# Altium schematic sheet schematic.SchDoc
size A4; SheetNumber: 6; SheetTotal: 29
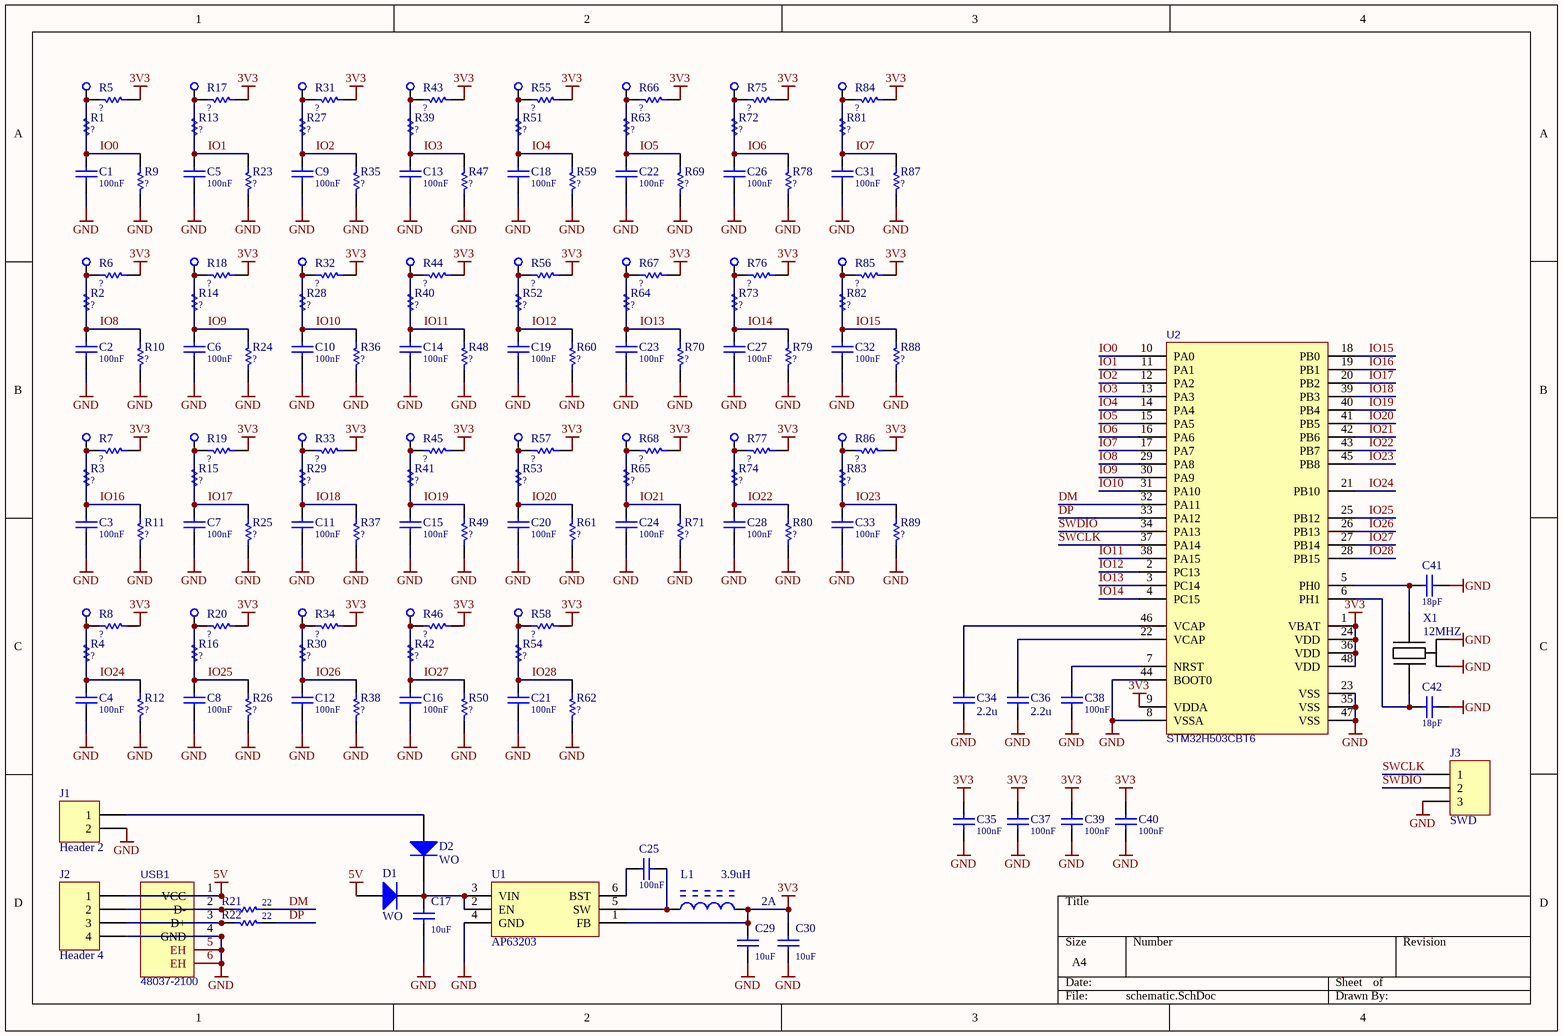
[diagram p0: schematic.SchDoc]

## Parts
C1  100nF  [C0603]
C2  100nF  [C0603]
C3  100nF  [C0603]
C4  100nF  [C0603]
C5  100nF  [C0603]
C6  100nF  [C0603]
C7  100nF  [C0603]
C8  100nF  [C0603]
C9  100nF  [C0603]
C10  100nF  [C0603]
C11  100nF  [C0603]
C12  100nF  [C0603]
C13  100nF  [C0603]
C14  100nF  [C0603]
C15  100nF  [C0603]
C16  100nF  [C0603]
C17  10uF  [C1206]
C18  100nF  [C0603]
C19  100nF  [C0603]
C20  100nF  [C0603]
C21  100nF  [C0603]
C22  100nF  [C0603]
C23  100nF  [C0603]
C24  100nF  [C0603]
C25  100nF  [C0402]
C26  100nF  [C0603]
C27  100nF  [C0603]
C28  100nF  [C0603]
C29  10uF  [C1206]
C30  10uF  [C1206]
C31  100nF  [C0603]
C32  100nF  [C0603]
C33  100nF  [C0603]
C34  2.2u  [C0603]
C35  100nF  [C0402]
C36  2.2u  [C0603]
C37  100nF  [C0402]
C38  100nF  [C0402]
C39  100nF  [C0402]
C40  100nF  [C0402]
C41  18pF  [C0402]
C42  18pF  [C0402]
D1  WO  [SMA]
D2  WO  [SMA]
DN1  (no value)  [PAD_CAST2_0.8MM]  (no BOM)
DN2  (no value)  [PAD_CAST2_0.8MM]  (no BOM)
DN3  (no value)  [PAD_CAST2_0.8MM]  (no BOM)
DN4  (no value)  [PAD_CAST2_0.8MM]  (no BOM)
DN5  (no value)  [PAD_CAST2_0.8MM]  (no BOM)
DN6  (no value)  [PAD_CAST2_0.8MM]  (no BOM)
DN7  (no value)  [PAD_CAST2_0.8MM]  (no BOM)
DN8  (no value)  [PAD_CAST2_0.8MM]  (no BOM)
DN9  (no value)  [PAD_CAST2_0.8MM]  (no BOM)
DN10  (no value)  [PAD_CAST2_0.8MM]  (no BOM)
DN11  (no value)  [PAD_CAST2_0.8MM]  (no BOM)
DN12  (no value)  [PAD_CAST2_0.8MM]  (no BOM)
DN13  (no value)  [PAD_CAST2_0.8MM]  (no BOM)
DN14  (no value)  [PAD_CAST2_0.8MM]  (no BOM)
DN15  (no value)  [PAD_CAST2_0.8MM]  (no BOM)
DN16  (no value)  [PAD_CAST2_0.8MM]  (no BOM)
DN17  (no value)  [PAD_CAST2_0.8MM]  (no BOM)
DN18  (no value)  [PAD_CAST2_0.8MM]  (no BOM)
DN19  (no value)  [PAD_CAST2_0.8MM]  (no BOM)
DN20  (no value)  [PAD_CAST2_0.8MM]  (no BOM)
DN21  (no value)  [PAD_CAST2_0.8MM]  (no BOM)
DN22  (no value)  [PAD_CAST2_0.8MM]  (no BOM)
DN23  (no value)  [PAD_CAST2_0.8MM]  (no BOM)
DN24  (no value)  [PAD_CAST2_0.8MM]  (no BOM)
DN25  (no value)  [PAD_CAST2_0.8MM]  (no BOM)
DN26  (no value)  [PAD_CAST2_0.8MM]  (no BOM)
DN27  (no value)  [PAD_CAST2_0.8MM]  (no BOM)
DN28  (no value)  [PAD_CAST2_0.8MM]  (no BOM)
DN29  (no value)  [PAD_CAST2_0.8MM]  (no BOM)
J1  Header 2  [HDR-1X2_2.54]  (no BOM)
J2  Header 4  [HDR-1X4_2.54]  (no BOM)
J3  SWD  [HDR-1X3_2.54]  (no BOM)
L1  3.9uH  [IND_5020_L5.0-W5.0]
R1  ?  [R0603]
R2  ?  [R0603]
R3  ?  [R0603]
R4  ?  [R0603]
R5  ?  [R0603]
R6  ?  [R0603]
R7  ?  [R0603]
R8  ?  [R0603]
R9  ?  [R0603]
R10  ?  [R0603]
R11  ?  [R0603]
R12  ?  [R0603]
R13  ?  [R0603]
R14  ?  [R0603]
R15  ?  [R0603]
R16  ?  [R0603]
R17  ?  [R0603]
R18  ?  [R0603]
R19  ?  [R0603]
R20  ?  [R0603]
R21  22  [R0603]
R22  22  [R0603]
R23  ?  [R0603]
R24  ?  [R0603]
R25  ?  [R0603]
R26  ?  [R0603]
R27  ?  [R0603]
R28  ?  [R0603]
R29  ?  [R0603]
R30  ?  [R0603]
R31  ?  [R0603]
R32  ?  [R0603]
R33  ?  [R0603]
R34  ?  [R0603]
R35  ?  [R0603]
R36  ?  [R0603]
R37  ?  [R0603]
R38  ?  [R0603]
R39  ?  [R0603]
R40  ?  [R0603]
R41  ?  [R0603]
R42  ?  [R0603]
R43  ?  [R0603]
R44  ?  [R0603]
R45  ?  [R0603]
R46  ?  [R0603]
R47  ?  [R0603]
R48  ?  [R0603]
R49  ?  [R0603]
R50  ?  [R0603]
R51  ?  [R0603]
R52  ?  [R0603]
R53  ?  [R0603]
R54  ?  [R0603]
R55  ?  [R0603]
R56  ?  [R0603]
R57  ?  [R0603]
R58  ?  [R0603]
R59  ?  [R0603]
R60  ?  [R0603]
R61  ?  [R0603]
R62  ?  [R0603]
R63  ?  [R0603]
R64  ?  [R0603]
R65  ?  [R0603]
R66  ?  [R0603]
R67  ?  [R0603]
R68  ?  [R0603]
R69  ?  [R0603]
R70  ?  [R0603]
R71  ?  [R0603]
R72  ?  [R0603]
R73  ?  [R0603]
R74  ?  [R0603]
R75  ?  [R0603]
R76  ?  [R0603]
R77  ?  [R0603]
R78  ?  [R0603]
R79  ?  [R0603]
R80  ?  [R0603]
R81  ?  [R0603]
R82  ?  [R0603]
R83  ?  [R0603]
R84  ?  [R0603]
R85  ?  [R0603]
R86  ?  [R0603]
R87  ?  [R0603]
R88  ?  [R0603]
R89  ?  [R0603]
U1  AP63203  [SOT-23-6]
U2  STM32H503CBT6  [LQFP-48]
USB1  48037-2100  [USB-A-TH_480372100]
X1  12MHZ  [CRYSTAL_2.5x2.0mm]

## Nets
3V3: C29.2 C30.2 C35.2 C37.2 C39.2 C40.2 L1.2 R5.1 R6.1 R7.1 R8.1 R17.1 R18.1 R19.1 R20.1 R31.1 R32.1 R33.1 R34.1 R43.1 R44.1 R45.1 R46.1 R55.1 R56.1 R57.1 R58.1 R66.1 R67.1 R68.1 R75.1 R76.1 R77.1 R84.1 R85.1 R86.1 U1.1(FB) U2.1(VBAT) U2.9(VDDA) U2.24(VDD) U2.36(VDD) U2.48(VDD)
5V: D1.1(A) J2.1 USB1.1(VCC)
GND: C1.1 C2.1 C3.1 C4.1 C5.1 C6.1 C7.1 C8.1 C9.1 C10.1 C11.1 C12.1 C13.1 C14.1 C15.1 C16.1 C17.1 C18.1 C19.1 C20.1 C21.1 C22.1 C23.1 C24.1 C26.1 C27.1 C28.1 C29.1 C30.1 C31.1 C32.1 C33.1 C34.1 C35.1 C36.1 C37.1 C38.1 C39.1 C40.1 C41.1 C42.1 J1.2 J2.4 J3.3 R9.1 R10.1 R11.1 R12.1 R23.1 R24.1 R25.1 R26.1 R35.1 R36.1 R37.1 R38.1 R47.1 R48.1 R49.1 R50.1 R59.1 R60.1 R61.1 R62.1 R69.1 R70.1 R71.1 R78.1 R79.1 R80.1 R87.1 R88.1 R89.1 U1.4(GND) U2.8(VSSA) U2.23(VSS) U2.35(VSS) U2.44(BOOT0) U2.47(VSS) USB1.4(GND) USB1.5(EH) USB1.6(EH) X1.2(GND) X1.4(GND)
DM: R21.2 U2.32(PA11)
DP: R22.2 U2.33(PA12)
IO0: C1.2 DN1.1 R1.1 R1.2 R5.2 R9.2 U2.10(PA0)
IO1: C5.2 DN5.1 R13.1 R13.2 R17.2 R23.2 U2.11(PA1)
IO2: C9.2 DN9.1 R27.1 R27.2 R31.2 R35.2 U2.12(PA2)
IO3: C13.2 DN13.1 R39.1 R39.2 R43.2 R47.2 U2.13(PA3)
IO4: C18.2 DN17.1 R51.1 R51.2 R55.2 R59.2 U2.14(PA4)
IO5: C22.2 DN21.1 R63.1 R63.2 R66.2 R69.2 U2.15(PA5)
IO6: C26.2 DN24.1 R72.1 R72.2 R75.2 R78.2 U2.16(PA6)
IO7: C31.2 DN27.1 R81.1 R81.2 R84.2 R87.2 U2.17(PA7)
IO8: C2.2 DN2.1 R2.1 R2.2 R6.2 R10.2 U2.29(PA8)
IO9: C6.2 DN6.1 R14.1 R14.2 R18.2 R24.2 U2.30(PA9)
IO10: C10.2 DN10.1 R28.1 R28.2 R32.2 R36.2 U2.31(PA10)
IO11: C14.2 DN14.1 R40.1 R40.2 R44.2 R48.2 U2.38(PA15)
IO12: C19.2 DN18.1 R52.1 R52.2 R56.2 R60.2 U2.2(PC13)
IO13: C23.2 DN22.1 R64.1 R64.2 R67.2 R70.2 U2.3(PC14)
IO14: C27.2 DN25.1 R73.1 R73.2 R76.2 R79.2 U2.4(PC15)
IO15: C32.2 DN28.1 R82.1 R82.2 R85.2 R88.2 U2.18(PB0)
IO16: C3.2 DN3.1 R3.1 R3.2 R7.2 R11.2 U2.19(PB1)
IO17: C7.2 DN7.1 R15.1 R15.2 R19.2 R25.2 U2.20(PB2)
IO18: C11.2 DN11.1 R29.1 R29.2 R33.2 R37.2 U2.39(PB3)
IO19: C15.2 DN15.1 R41.1 R41.2 R45.2 R49.2 U2.40(PB4)
IO20: C20.2 DN19.1 R53.1 R53.2 R57.2 R61.2 U2.41(PB5)
IO21: C24.2 DN23.1 R65.1 R65.2 R68.2 R71.2 U2.42(PB6)
IO22: C28.2 DN26.1 R74.1 R74.2 R77.2 R80.2 U2.43(PB7)
IO23: C33.2 DN29.1 R83.1 R83.2 R86.2 R89.2 U2.45(PB8)
IO24: C4.2 DN4.1 R4.1 R4.2 R8.2 R12.2 U2.21(PB10)
IO25: C8.2 DN8.1 R16.1 R16.2 R20.2 R26.2 U2.25(PB12)
IO26: C12.2 DN12.1 R30.1 R30.2 R34.2 R38.2 U2.26(PB13)
IO27: C16.2 DN16.1 R42.1 R42.2 R46.2 R50.2 U2.27(PB14)
IO28: C21.2 DN20.1 R54.1 R54.2 R58.2 R62.2 U2.28(PB15)
SWCLK: J3.1 U2.37(PA14)
SWDIO: J3.2 U2.34(PA13)
NetC17_2: C17.2 D1.2(K) D2.2(K) U1.2(EN) U1.3(VIN)
NetC25_1: C25.1 L1.1 U1.5(SW)
NetC25_2: C25.2 U1.6(BST)
NetC34_2: C34.2 U2.46(VCAP)
NetC36_2: C36.2 U2.22(VCAP)
NetC38_2: C38.2 U2.7(NRST)
NetC41_2: C41.2 U2.5(PH0) X1.3(X2)
NetC42_2: C42.2 U2.6(PH1) X1.1(X1)
NetD2_1: D2.1(A) J1.1
NetJ2_2: J2.2 R21.1 USB1.2(D-)
NetJ2_3: J2.3 R22.1 USB1.3(D+)

## Notes on the sheet
- 2A

## Library data of the parts
C1-C16 C18-C24 C26-C28 C31-C33 = CAP: 100nF 0603
C17 C29 C30 = CAP: 10uf 50V 1206; P/N: CL31B106KBHNNNE; LCSC part number: C89632
C25 = CAP: 100nF 0402; P/N: CC0402KRX7R9BB104; LCSC part number: C131394
C34 C36 = Cap
C35 C37-C40 = CAP
C41 C42 = CAP: 18pF 50V 0402; P/N: GRM1555C1H180JA01D; LCSC part number: C33149
D1 D2 = US1M-13-F
DN1-DN29 = dummy net
J3 = Header 3
L1 = SRN3015-100M: 3.9uH 2A; P/N: SWPA5020S3R9NT; LCSC part number: C115009
R1-R89 = RES
U1 = AP63203: P/N: AP63203WU-7; LCSC part number: C780769
X1 = CRYSTAL 12MHZ 3.20mm x 2.50mm: CRYSTAL 12MHZ 10PF SMD; P/N: TXM12M0004252FBCEO00T; LCSC part number: C284155
USB1 = 48037-2100: LCSC part number: C136453; P/N: 48037-2100